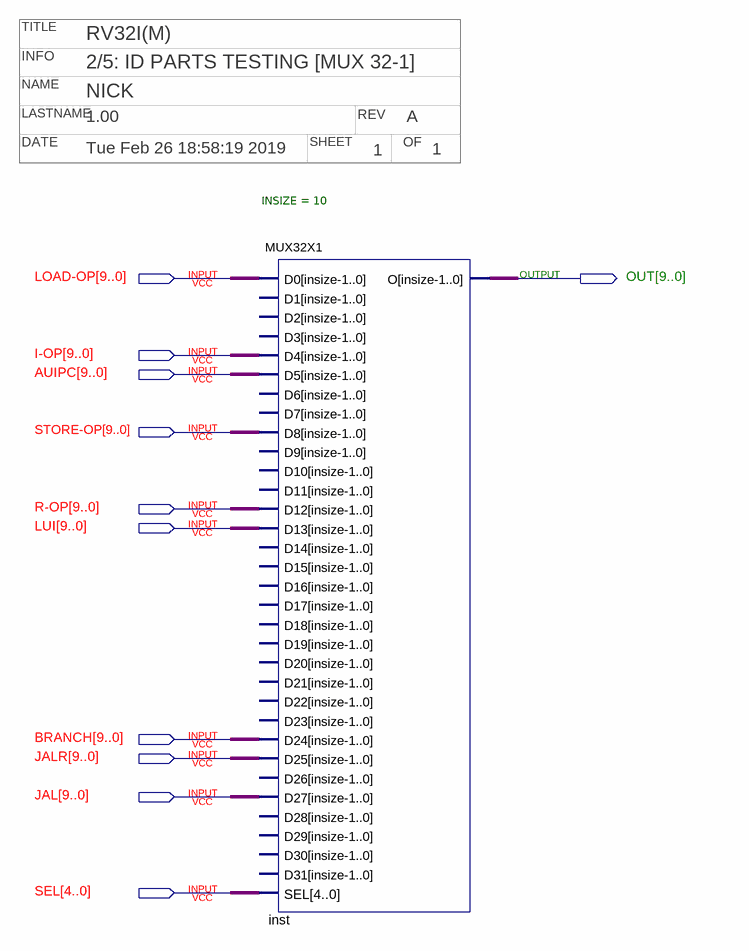
[diagram p0: schematic sheet]
// Quartus schematic MUX32X1TEST.bdf as structural Verilog: 1 symbols, 11 pins
// Title block: TITLE: RV32I(M); INFO: 2/5: ID PARTS TESTING [MUX 32-1]; NAME: NICK; LASTNAME: 1.00; REV: A; DATE: Tue Feb 26 18:58:19 2019; SHEET: 1; OF: 1
module MUX32X1TEST (
  input  [9:0] \LOAD-OP ,
  input  [9:0] \I-OP ,
  input  [9:0] AUIPC,
  input  [9:0] \STORE-OP ,
  input  [9:0] \R-OP ,
  input  [9:0] LUI,
  input  [9:0] BRANCH,
  input  [9:0] JALR,
  input  [9:0] JAL,
  input  [4:0] SEL,
  output [9:0] OUT
);

  MUX32X1 #(.INSIZE(10)) inst (
    .D0(\LOAD-OP ), .D4(\I-OP ), .D5(AUIPC), .D8(\STORE-OP ), .D12(\R-OP ), .D13(LUI), .D24(BRANCH),
    .D25(JALR), .D27(JAL), .SEL(SEL), .O(OUT));  // open: D1, D2, D3, D6, D7, D9, D10, D11, D14, D15, D16, D17, D18, D19, D20, D21, D22, D23, D26, D28, D29, D30, D31
endmodule
